# EAGLE design base-1 (EAGLE 9.6.2)
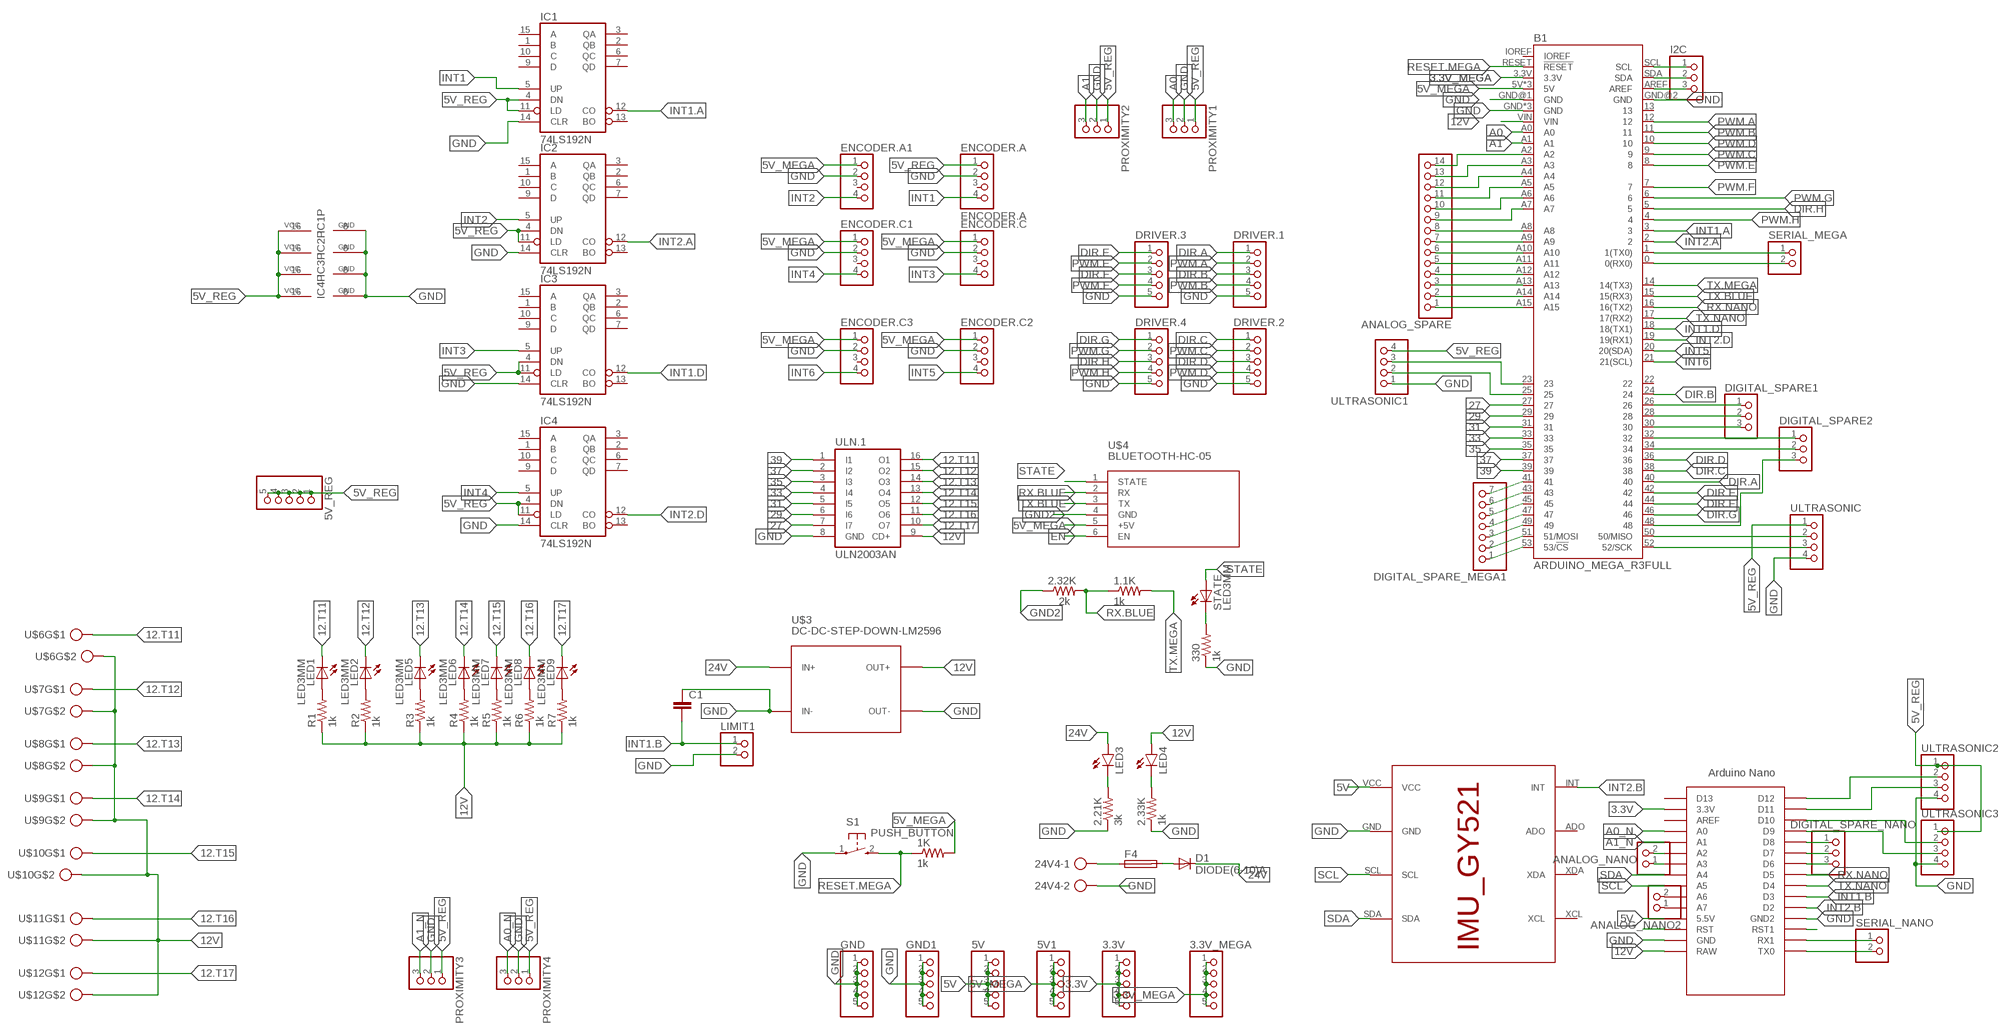
[diagram p0: schematic, sheet 1]

## Parts
1.1K  1k  RES-5  [0204/5]
1K  1k  RES-5  [0204/5]
2.21K  3k  RES-5  [0204/5]
2.32K  2k  RES-5  [0204/5]
2.33K  1k  RES-5  [0204/5]
3.3V  PINHD-1X5  [1X05]
3.3V_MEGA  PINHD-1X5  [1X05]
5V  PINHD-1X5  [1X05]
5V1  PINHD-1X5  [1X05]
5V_REG  PINHD-1X5  [1X05]
24V4  ROSTA.POWER  [W239-302]
330  1k  RES-5  [0204/5]
ANALOG_NANO  PINHD-1X2  [1X02]
ANALOG_NANO2  PINHD-1X2  [1X02]
ANALOG_SPARE  PINHD-1X14  [1X14]
B1  ARDUINO_MEGA_R3FULL  [ARDUINO_MEGA_NO_SILK]
C1  CAPACITOR  [C025-025X050]
D1  DIODE(6-10)A  [DO201-15]
DIGITAL_SPARE1  PINHD-1X3  [1X03]
DIGITAL_SPARE2  PINHD-1X3  [1X03]
DIGITAL_SPARE_MEGA1  PINHD-1X7  [1X07]
DIGITAL_SPARE_NANO  PINHD-1X3  [1X03]
DRIVER.1  PINHD-1X5  [1X05]
DRIVER.2  PINHD-1X5  [1X05]
DRIVER.3  PINHD-1X5  [1X05]
DRIVER.4  PINHD-1X5  [1X05]
ENCODER.A  ENCODER.A  PINHD-1X4  [1X04]
ENCODER.A1  PINHD-1X4  [1X04]
ENCODER.C  PINHD-1X4  [1X04]
ENCODER.C1  PINHD-1X4  [1X04]
ENCODER.C2  PINHD-1X4  [1X04]
ENCODER.C3  PINHD-1X4  [1X04]
F4  FUSE_HOLDER  [SH22,5A]
GND  PINHD-1X5  [1X05]
GND1  PINHD-1X5  [1X05]
I2C  PINHD-1X3  [1X03]
IC1  74LS192N  [DIL16]
IC2  74LS192N  [DIL16]
IC3  74LS192N  [DIL16]
IC4  74LS192N  [DIL16]
LED1  LED3MM  [LED3MM]
LED2  LED3MM  [LED3MM]
LED3  LED5MM  [LED5MM]
LED4  LED5MM  [LED5MM]
LED5  LED3MM  [LED3MM]
LED6  LED3MM  [LED3MM]
LED7  LED3MM  [LED3MM]
LED8  LED3MM  [LED3MM]
LED9  LED3MM  [LED3MM]
LIMIT1  PINHD-1X2  [1X02]
PROXIMITY1  PINHD-1X3  [1X03]
PROXIMITY2  PINHD-1X3  [1X03]
PROXIMITY3  PINHD-1X3  [1X03]
PROXIMITY4  PINHD-1X3  [1X03]
R1  1k  RES-5  [0204/5]
R2  1k  RES-5  [0204/5]
R3  1k  RES-5  [0204/5]
R4  1k  RES-5  [0204/5]
R5  1k  RES-5  [0204/5]
R6  1k  RES-5  [0204/5]
R7  1k  RES-5  [0204/5]
S1  PUSH_BUTTON  [B3F-10XX]
SERIAL_MEGA  PINHD-1X2  [1X02]
SERIAL_NANO  PINHD-1X2  [1X02]
STATE  LED3MM  [LED3MM]
U$1  ARDUINO_NANO  [NANO]
U$3  DC-DC-STEP-DOWN-LM2596  [DC-DC-STEP-DOWN-LM2596]
U$4  BLUETOOTH-HC-05  [WIRELESS-BLUETOOTH-HC-05]
U$5  IMU_ROBOCON_GY521  [IMU_GY521]
U$6  CON_PTR_2  [AK300/2]
U$7  CON_PTR_2  [AK300/2]
U$8  CON_PTR_2  [AK300/2]
U$9  CON_PTR_2  [AK300/2]
U$10  CON_PTR_2  [AK300/2]
U$11  CON_PTR_2  [AK300/2]
U$12  CON_PTR_2  [AK300/2]
ULN.1  ULN2003AN  [DIL16]
ULTRASONIC  PINHD-1X4  [1X04]
ULTRASONIC1  PINHD-1X4  [1X04]
ULTRASONIC2  PINHD-1X4  [1X04]
ULTRASONIC3  PINHD-1X4  [1X04]

## Nets
3.3V: 3.3V.1 3.3V.2 3.3V.3 3.3V.4 3.3V.5 U$1.3.3V
3.3V_MEGA: 3.3V_MEGA.1 3.3V_MEGA.2 3.3V_MEGA.3 3.3V_MEGA.4 3.3V_MEGA.5 B1.3.3V
5V: 5V.1 5V.2 5V.3 5V.4 5V.5 U$1.5V(5.5V) U$5.VCC
5V_MEGA: 1K.2 5V1.1 5V1.2 5V1.3 5V1.4 5V1.5 B1.5V B1.5V@1(5V) B1.5V@2(5V) ENCODER.A1.1 ENCODER.C1.1 ENCODER.C2.1 ENCODER.C3.1 ENCODER.C.1 U$4.5(+5V)
5V_REG: 5V_REG.1 5V_REG.2 5V_REG.3 5V_REG.4 5V_REG.5 ENCODER.A.1 IC1.4(DN) IC1.11(LD) IC1.16(VCC) IC2.4(DN) IC2.11(LD) IC2.16(VCC) IC3.4(DN) IC3.11(LD) IC3.16(VCC) IC4.4(DN) IC4.11(LD) IC4.16(VCC) PROXIMITY1.1 PROXIMITY2.1 PROXIMITY3.1 PROXIMITY4.1 ULTRASONIC1.4 ULTRASONIC2.1 ULTRASONIC3.1 ULTRASONIC.1
12.T11: LED1.K(C) U$6.1 ULN.1.16(O1)
12.T12: LED2.K(C) U$7.1 ULN.1.15(O2)
12.T13: LED5.K(C) U$8.1 ULN.1.14(O3)
12.T14: LED6.K(C) U$9.1 ULN.1.13(O4)
12.T15: LED7.K(C) U$10.1 ULN.1.12(O5)
12.T16: LED8.K(C) U$11.1 ULN.1.11(O6)
12.T17: LED9.K(C) U$12.1 ULN.1.10(O7)
12V: B1.VIN LED4.A R1.1 R2.1 R3.1 R4.1 R5.1 R6.1 R7.1 U$1.RAW U$3.OUT+ U$6.2 U$7.2 U$8.2 U$9.2 U$10.2 U$11.2 U$12.2 ULN.1.9(CD+)
24V: D1.C LED3.A U$3.IN+
27: B1.27 ULN.1.7(I7)
29: B1.29 ULN.1.6(I6)
31: B1.31 ULN.1.5(I5)
33: B1.33 ULN.1.4(I4)
35: B1.35 ULN.1.3(I3)
37: B1.37 ULN.1.2(I2)
39: B1.39 ULN.1.1(I1)
48: B1.48 DIGITAL_SPARE2.3
A0: B1.A0 PROXIMITY1.3
A0_N: PROXIMITY4.3 U$1.A0
A1: B1.A1 PROXIMITY2.3
A1_N: PROXIMITY3.3 U$1.A1
DIR.A: B1.40 DRIVER.1.1
DIR.B: B1.24 DRIVER.1.3
DIR.C: B1.38 DRIVER.2.1
DIR.D: B1.36 DRIVER.2.3
DIR.E: B1.42 DRIVER.3.1
DIR.F: B1.44 DRIVER.3.3
DIR.G: B1.46 DRIVER.4.1
DIR.H: B1.5 DRIVER.4.3
EN: U$4.6(EN)
GND: 2.21K.1 2.33K.1 24V4.2 330.1 B1.GND B1.GND@1(GND) B1.GND@2(GND) B1.GND@3(GND) B1.GND@4(GND) C1.1 DRIVER.1.5 DRIVER.2.5 DRIVER.3.5 DRIVER.4.5 ENCODER.A1.2 ENCODER.A.2 ENCODER.C1.2 ENCODER.C2.2 ENCODER.C3.2 ENCODER.C.2 GND1.1 GND1.2 GND1.3 GND1.4 GND1.5 GND.1 GND.2 GND.3 GND.4 GND.5 IC1.8(GND) IC1.14(CLR) IC2.8(GND) IC2.14(CLR) IC3.8(GND) IC3.14(CLR) IC4.8(GND) IC4.14(CLR) LIMIT1.2 PROXIMITY1.2 PROXIMITY2.2 PROXIMITY3.2 PROXIMITY4.2 S1.1(P) U$1.GND U$1.GND1(GND2) U$3.IN- U$3.OUT- U$5.GND ULN.1.8(GND) ULTRASONIC1.1 ULTRASONIC2.4 ULTRASONIC3.4 ULTRASONIC.4
GND2: 2.32K.1 U$4.4(GND)
INT1: ENCODER.A.4 IC1.5(UP)
INT1.A: B1.3 IC1.12(CO)
INT1.B: C1.2 LIMIT1.1 U$1.D3
INT1.D: B1.18(18(TX1)) IC3.12(CO)
INT2: ENCODER.A1.4 IC2.5(UP)
INT2.A: B1.2 IC2.12(CO)
INT2.B: U$1.D2 U$5.INT
INT2.D: B1.19(19(RX1)) IC4.12(CO)
INT3: ENCODER.C.4 IC3.5(UP)
INT4: ENCODER.C1.4 IC4.5(UP)
INT5: B1.20(20(SDA)) ENCODER.C2.4
INT6: B1.21(21(SCL)) ENCODER.C3.4
N$1: B1.SCL I2C.1
N$2: B1.SDA I2C.2
N$3: B1.AREF I2C.3
N$6: ANALOG_SPARE.1 B1.A15
N$7: 24V4.1 F4.1
N$8: ANALOG_SPARE.2 B1.A14
N$9: ANALOG_SPARE.3 B1.A13
N$10: ANALOG_SPARE.4 B1.A12
N$11: ANALOG_SPARE.5 B1.A11
N$12: ANALOG_SPARE.6 B1.A10
N$13: ANALOG_SPARE.7 B1.A9
N$14: ANALOG_SPARE.8 B1.A8
N$15: ANALOG_SPARE.9 B1.A7
N$17: B1.1(1(TX0)) SERIAL_MEGA.1
N$18: B1.0(0(RX0)) SERIAL_MEGA.2
N$21: 330.2 STATE.K(C)
N$23: 2.21K.2 LED3.K(C)
N$24: 2.33K.2 LED4.K(C)
N$25: D1.A F4.2
N$27: LED1.A R1.2
N$28: LED2.A R2.2
N$29: LED5.A R3.2
N$30: LED6.A R4.2
N$31: LED7.A R5.2
N$32: LED8.A R6.2
N$33: LED9.A R7.2
N$35: B1.23 ULTRASONIC1.3
N$36: B1.25 ULTRASONIC1.2
N$39: ANALOG_NANO.1 U$1.A3
N$40: ANALOG_NANO.2 U$1.A2
N$41: B1.50(50/MISO) ULTRASONIC.2
N$42: B1.52(52/SCK) ULTRASONIC.3
N$43: ANALOG_NANO2.1 U$1.A7
N$44: ANALOG_NANO2.2 U$1.A6
N$46: B1.26 DIGITAL_SPARE1.1
N$47: ANALOG_SPARE.10 B1.A6
N$48: ANALOG_SPARE.11 B1.A5
N$49: ANALOG_SPARE.12 B1.A4
N$50: B1.28 DIGITAL_SPARE1.2
N$51: B1.30 DIGITAL_SPARE1.3
N$52: ANALOG_SPARE.13 B1.A3
N$53: ANALOG_SPARE.14 B1.A2
N$54: B1.32 DIGITAL_SPARE2.1
N$55: B1.34 DIGITAL_SPARE2.2
N$75: B1.41 DIGITAL_SPARE_MEGA1.7
N$76: B1.45 DIGITAL_SPARE_MEGA1.5
N$77: B1.43 DIGITAL_SPARE_MEGA1.6
N$78: B1.47 DIGITAL_SPARE_MEGA1.4
N$79: B1.49 DIGITAL_SPARE_MEGA1.3
N$80: B1.51(51/MOSI) DIGITAL_SPARE_MEGA1.2
N$81: B1.53(53/!CS) DIGITAL_SPARE_MEGA1.1
N$119: U$1.RST
N$122: U$1.D12 ULTRASONIC2.2
N$123: U$1.D11 ULTRASONIC2.3
N$124: U$1.D10 ULTRASONIC3.2
N$125: U$1.D9 ULTRASONIC3.3
N$126: DIGITAL_SPARE_NANO.1 U$1.D8
N$127: DIGITAL_SPARE_NANO.2 U$1.D7
N$128: DIGITAL_SPARE_NANO.3 U$1.D6
N$134: U$1.RST1
N$135: SERIAL_NANO.1 U$1.RX1
N$136: SERIAL_NANO.2 U$1.TX0
PWM.A: B1.12 DRIVER.1.2
PWM.B: B1.11 DRIVER.1.4
PWM.C: B1.9 DRIVER.2.2
PWM.D: B1.10 DRIVER.2.4
PWM.E: B1.8 DRIVER.3.2
PWM.F: B1.7 DRIVER.3.4
PWM.G: B1.6 DRIVER.4.2
PWM.H: B1.4 DRIVER.4.4
RESET.MEGA: 1K.1 B1.RESET(!RESET) S1.2(S)
RX.BLUE: 1.1K.1 2.32K.2 U$4.2(RX)
RX.NANO: B1.16(16(TX2)) U$1.D5
SCL: U$1.A5 U$5.SCL
SDA: U$1.A4 U$5.SDA
STATE: STATE.A U$4.1(STATE)
TX.BLUE: B1.15(15(RX3)) U$4.3(TX)
TX.MEGA: 1.1K.2 B1.14(14(TX3))
TX.NANO: B1.17(17(RX2)) U$1.D4
Unconnected: B1.13 B1.22 B1.IOREF ENCODER.A1.3 ENCODER.A.3 ENCODER.C1.3 ENCODER.C2.3 ENCODER.C3.3 ENCODER.C.3 IC1.1(B) IC1.2(QB) IC1.3(QA) IC1.6(QC) IC1.7(QD) IC1.9(D) IC1.10(C) IC1.13(BO) IC1.15(A) IC2.1(B) IC2.2(QB) IC2.3(QA) IC2.6(QC) IC2.7(QD) IC2.9(D) IC2.10(C) IC2.13(BO) IC2.15(A) IC3.1(B) IC3.2(QB) IC3.3(QA) IC3.6(QC) IC3.7(QD) IC3.9(D) IC3.10(C) IC3.13(BO) IC3.15(A) IC4.1(B) IC4.2(QB) IC4.3(QA) IC4.6(QC) IC4.7(QD) IC4.9(D) IC4.10(C) IC4.13(BO) IC4.15(A) U$1.AREF U$1.D13 U$5.ADO U$5.XCL U$5.XDA

## Library data of the parts
1.1K 1K 2.21K 2.32K 2.33K 330 R1-R7 = MIA_LIBRARY-2-2-2:RES-5
3.3V 3.3V_MEGA 5V 5V1 5V_REG DRIVER.1-DRIVER.4 GND GND1 = pinhead:PINHD-1X5: PIN HEADER
24V4 = MIA_LIBRARY-2-2-2:ROSTA.POWER: WAGO SCREW CLAMP; OC_FARNELL: unknown; OC_NEWARK: unknown
ANALOG_NANO ANALOG_NANO2 LIMIT1 SERIAL_MEGA SERIAL_NANO = pinhead:PINHD-1X2: PIN HEADER
ANALOG_SPARE = pinhead:PINHD-1X14: PIN HEADER
B1 = MIA_LIBRARY-2-2-2:ARDUINO_MEGA_R3: Arduino Mega R3 ATmega2560 R3 compatible footprint. SparkFun Products: Arduino Mega 2560 R3 <https://www.sparkfun.com/products/11061>
C1 = MIA_LIBRARY-2-2-2:CAPACITOR
D1 = MIA_LIBRARY-2-2-2:DIODE(6-10)A: DIODE controlled avalanche rectifier
DIGITAL_SPARE1 DIGITAL_SPARE2 DIGITAL_SPARE_NANO I2C PROXIMITY1-PROXIMITY4 = pinhead:PINHD-1X3: PIN HEADER
DIGITAL_SPARE_MEGA1 = pinhead:PINHD-1X7: PIN HEADER
ENCODER.A ENCODER.A1 ENCODER.C ENCODER.C1-ENCODER.C3 ULTRASONIC ULTRASONIC1-ULTRASONIC3 = pinhead:PINHD-1X4: PIN HEADER
F4 = MIA_LIBRARY-2-2-2:FUSE_HOLDER
IC1-IC4 = 74xx-us:74*192: Synchronous 4-bit UP/DOWN COUNTER
LED1 LED2 LED5-LED9 STATE = MIA_LIBRARY-2-2-2:LED3MM
LED3 LED4 = led:LED: LED OSRAM: - CHIPLED LG R971, LG N971, LY N971, LG Q971, LY Q971, LO R971, LY R971 LH N974, LH R974 LS Q976, LO Q976, LY Q976 LO Q996 - Hyper CHIPLED LW Q18S LB Q993, LB Q99A, LB R99A - SideLED LS A670, LO A670, LY A670, LG A670, LP A670 LB A673, LV A673, LT A673, LW A673 LH A674 LY A675 LS A676, LA A676, LO A676, LY A676, LW A676 LS A679, LY A679, LG A679 - Hyper Micro SIDELED® LS Y876, LA Y876, LO Y876, LY Y876 LT Y87S - SmartLED LW L88C, LW L88S LB L89C, LB L89S, LG L890 LS L89K, LO L89K, LY L89K LS L896, LA L896, LO L896, LY L896 - TOPLED LS T670, LO T670, LY T670, LG T670, LP T670 LSG T670, LSP T670, LSY T670, LOP T670, LYG T670 LG T671, LOG T671, LSG T671 LB T673, LV T673, LT T673, LW T673 LH T674 LS T676, LA T676, LO T676, LY T676, LB T676, LH T676, LSB T676, LW T676 LB T67C, LV T67C, LT T67C, LS T67K, LO T67K, LY T67K, LW E67C LS E67B, LA E67B, LO E67B, LY E67B, LB E67C, LV E67C, LT E67C LW T67C LS T679, LY T679, LG T679 LS T770, LO T770, LY T770, LG T770, LP T770 LB T773, LV T773, LT T773, LW T773 LH T774 LS E675, LA E675, LY E675, LS T675 LS T776, LA T776, LO T776, LY T776, LB T776 LHGB T686 LT T68C, LB T68C - Hyper Mini TOPLED® LB M676 - Mini TOPLED Santana® LG M470 LS M47K, LO M47K, LY M47K Source: http://www.osram.convergy.de LUXEON: - LUMILED® LXK2-PW12-R00, LXK2-PW12-S00, LXK2-PW14-U00, LXK2-PW14-V00 LXK2-PM12-R00, LXK2-PM12-S00, LXK2-PM14-U00 LXK2-PE12-Q00, LXK2-PE12-R00, LXK2-PE12-S00, LXK2-PE14-T00, LXK2-PE14-U00 LXK2-PB12-K00, LXK2-PB12-L00, LXK2-PB12-M00, LXK2-PB14-N00, LXK2-PB14-P00, LXK2-PB14-Q00 LXK2-PR12-L00, LXK2-PR12-M00, LXK2-PR14-Q00, LXK2-PR14-R00 LXK2-PD12-Q00, LXK2-PD12-R00, LXK2-PD12-S00 LXK2-PH12-R00, LXK2-PH12-S00 LXK2-PL12-P00, LXK2-PL12-Q00, LXK2-PL12-R00 Source: www.luxeon.com KINGBRIGHT: KA-3528ASYC Source: www.kingbright.com
S1 = MIA_LIBRARY-2-2-2:PUSH_BUTTON: OMRON SWITCH
U$1 = MIA_LIBRARY-2-2-2:ARDUINO_NANO: Arduino Nano
U$3 = MIA_LIBRARY-2-2-2:DC-DC-STEP-DOWN-LM2596: DC/DC Step-Down Regulator based on LM2596-ADJ chip LM2596 datasheet available here: http://www.ti.com/lit/ds/symlink/lm2596.pdf Click here to find device on ebay.com <http://www.ebay.com/sch/lm2596+power+regulator>
U$4 = MIA_LIBRARY-2-2-2:BLUETOOTH-HC-05: Bluetooth Transceiver Module based on HC-05 board Tutorial is available here: https://arduino-info.wikispaces.com/BlueTooth-HC05-HC06-Modules-How-To Click here to find device on ebay.com <http://www.ebay.com/sch/hc-05+module+rs232>
U$5 = MIA_LIBRARY-2-2-2:IMU_ROBOCON_GY521
U$6-U$12 = MIA_LIBRARY-2-2-2:CON_PTR_2
ULN.1 = MIA_LIBRARY-2-2-2:ULN2003A: DRIVER ARRAY

## Board
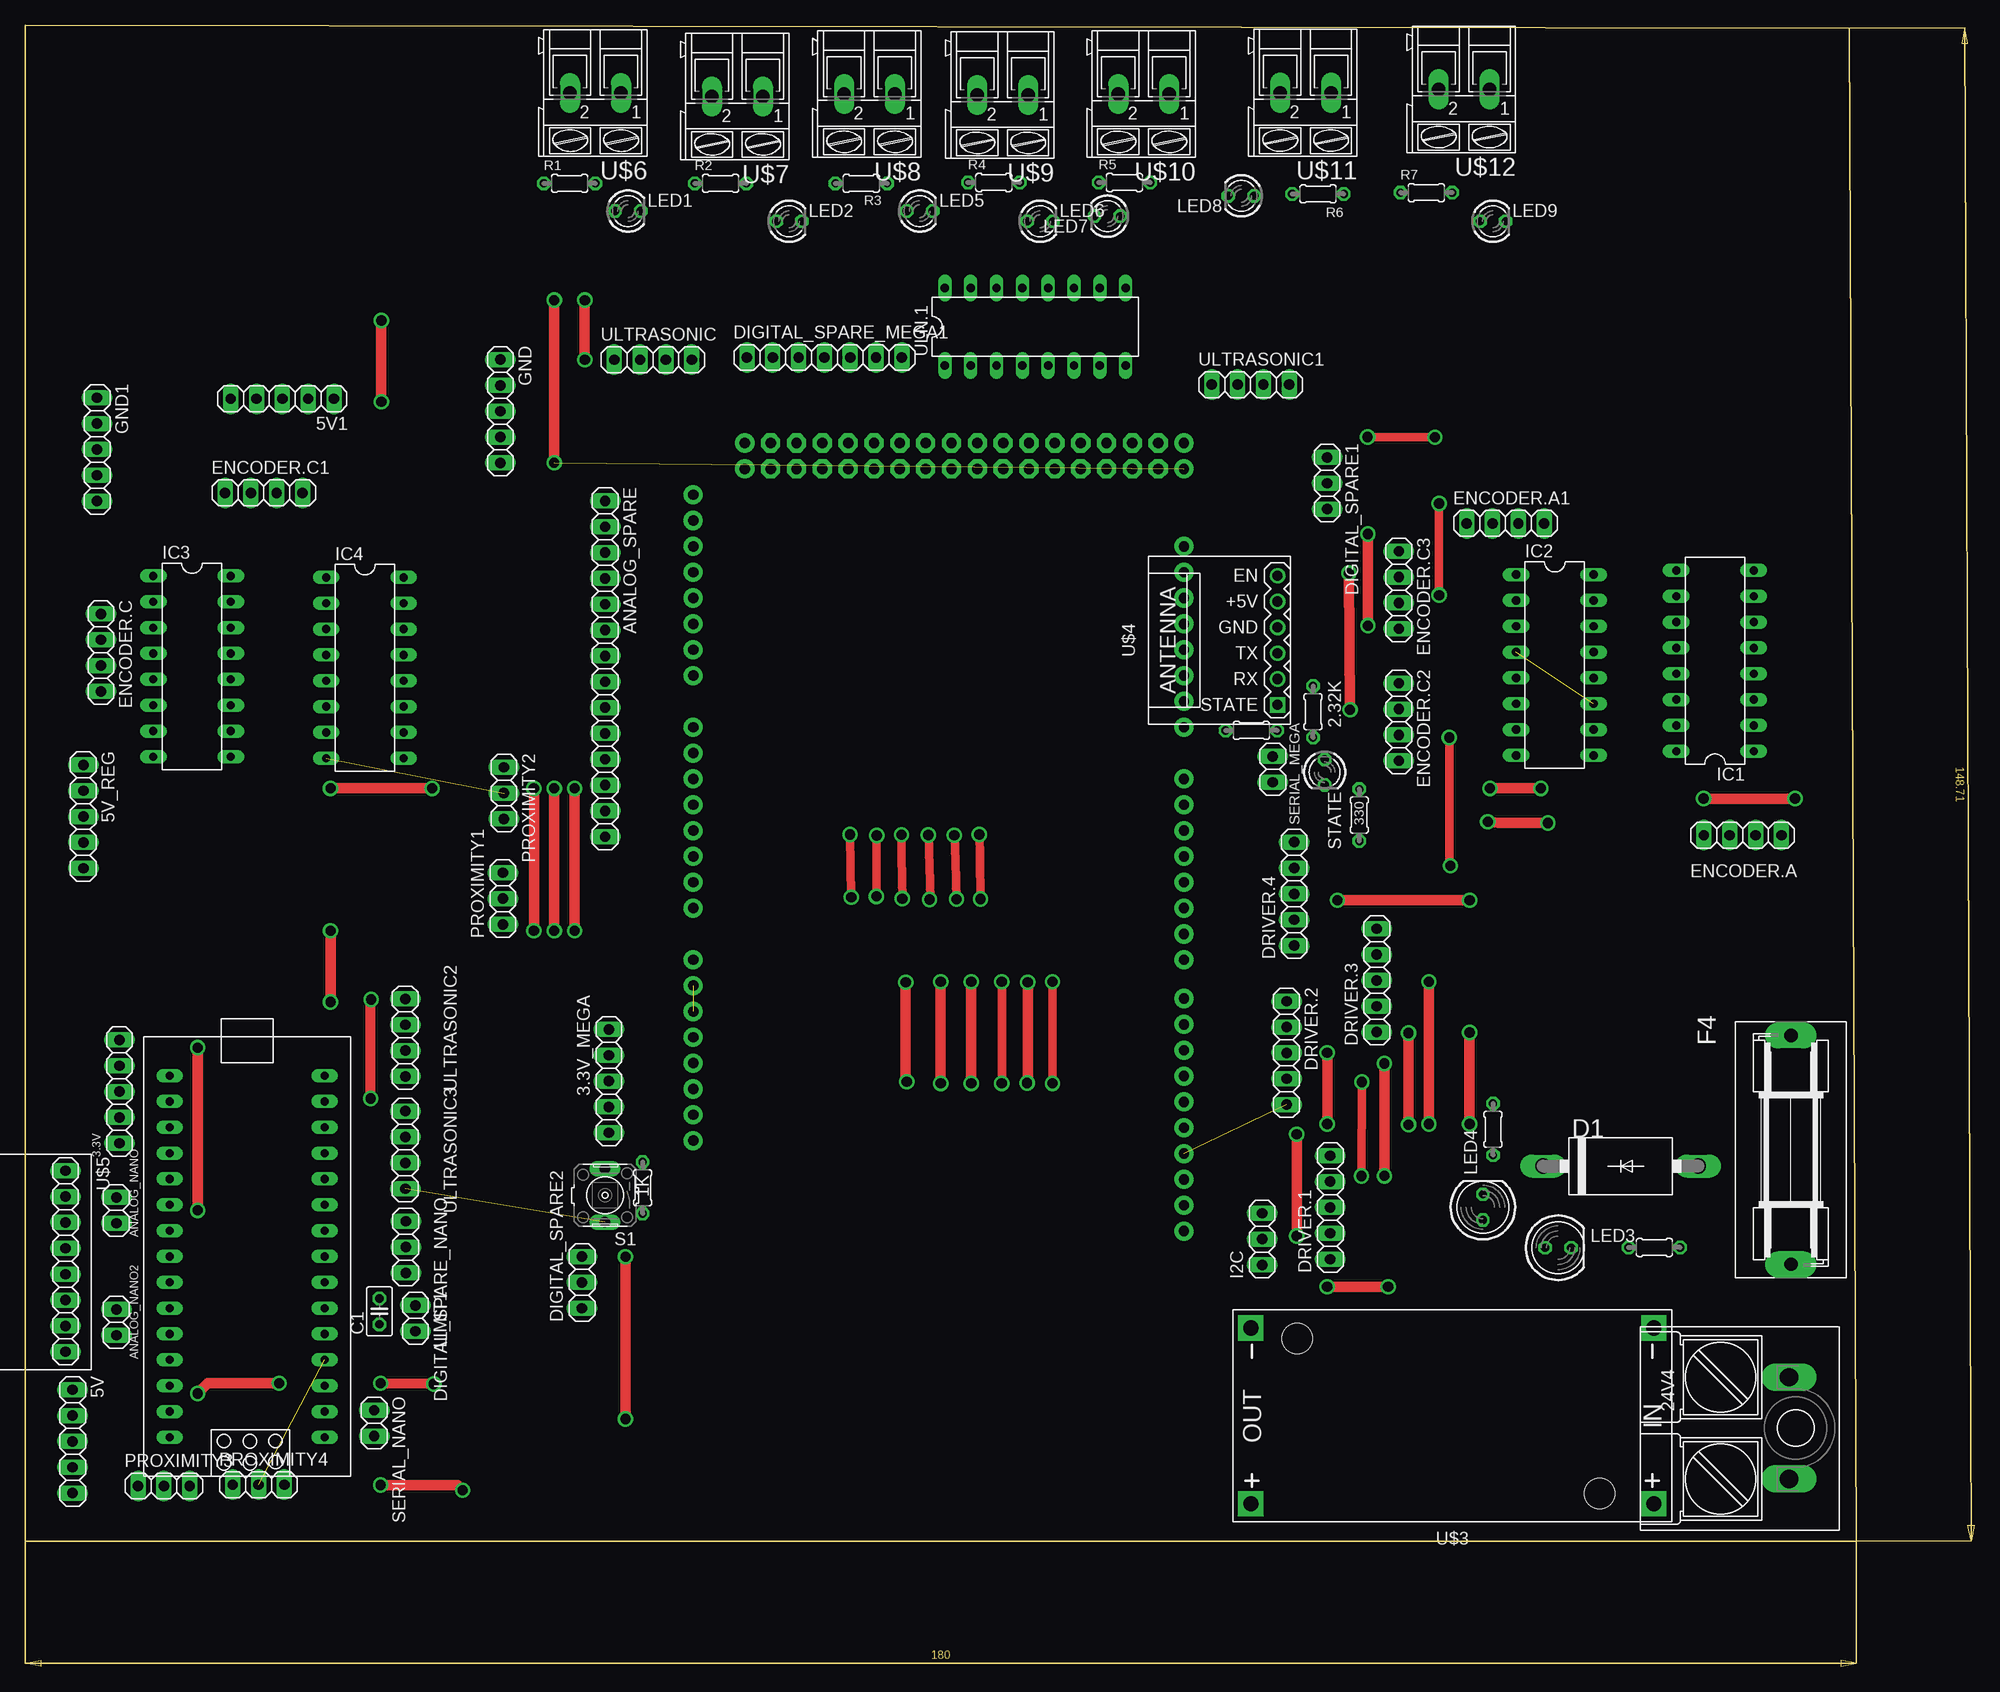
[diagram p1: board, top side]
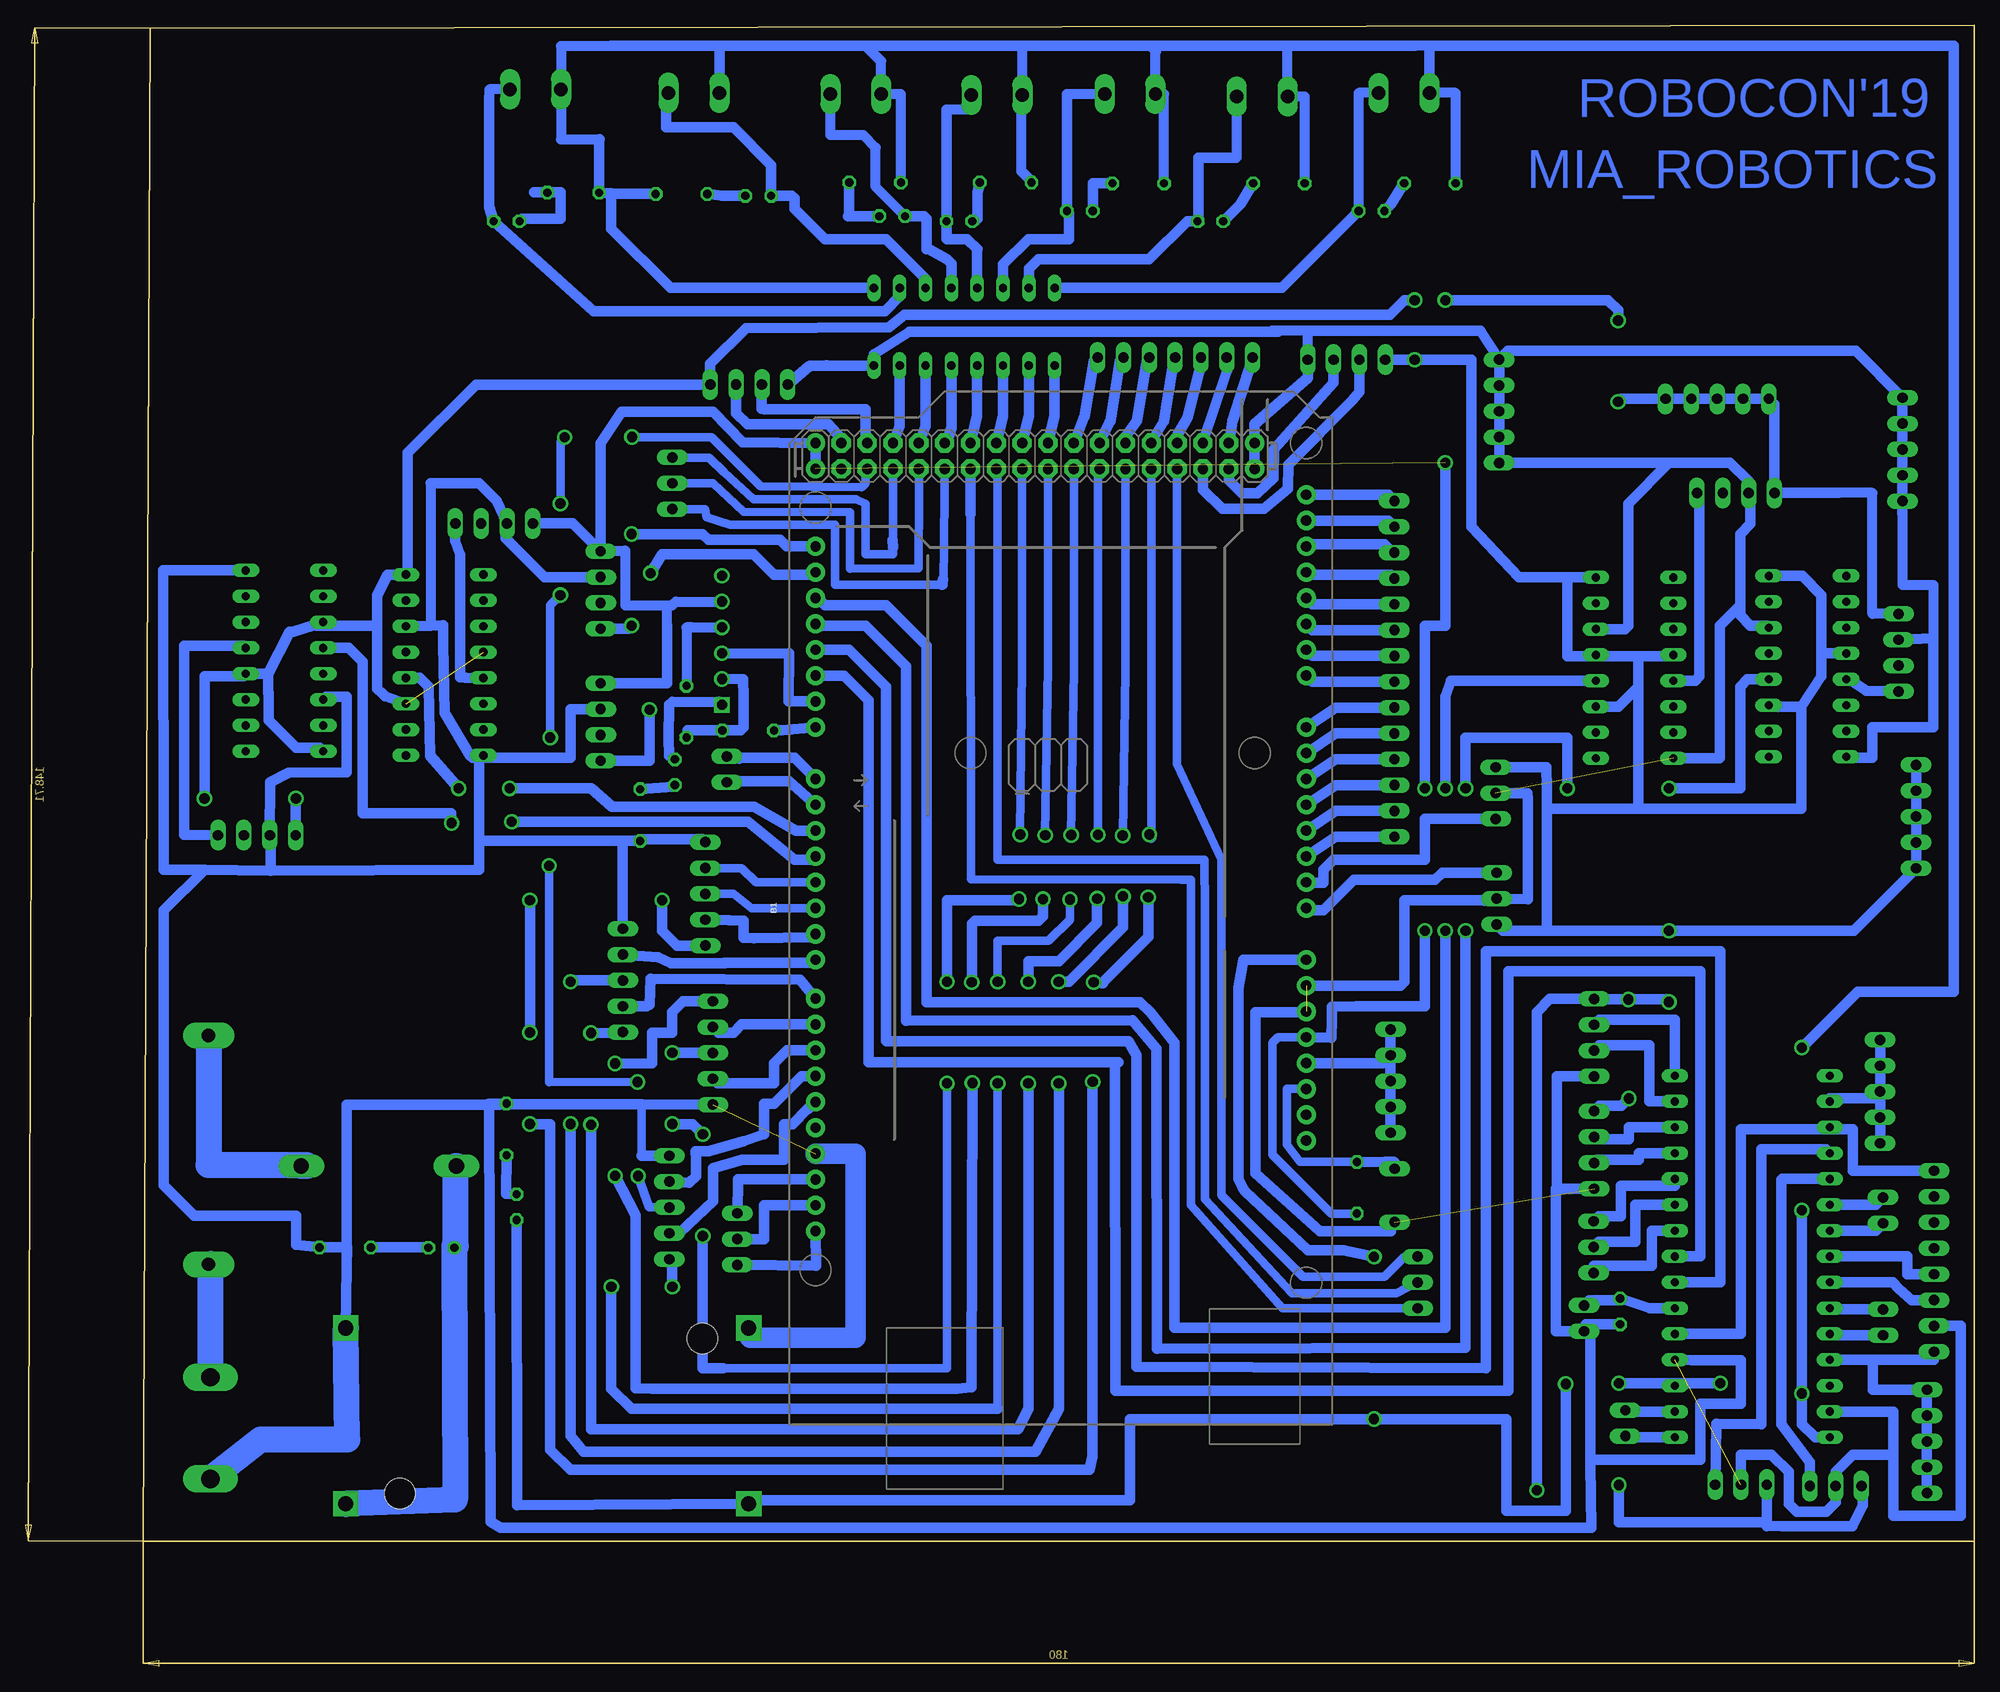
[diagram p2: board, bottom side, seen from below]

Size 180 x 149 mm. Coordinates in mm from the lower left corner, seen from the top.
Outline: 0,0 180,0 179.35,148.71 0,149 0,0
Copper layers (1*16): Top 0.035mm / dielectric 1.5mm / Bottom 0.035mm
Design rules "default *": minimum track width 0.8mm, minimum drill 0.8mm, track to track 0.4mm, track to pad 0.4mm, pad to pad 6mil, via to via 6mil, smd to smd 6mil, copper to edge 0.6mm, drill to drill 6mil, minimum pad ring 10mil, minimum via ring 8mil, stop-mask expansion 4mil, vias tented up to drill 0mil, thermal gap 10mil

### Footprints (pad centres in the part's own frame; a part is rotated, then mirrored left to right if it is on the bottom)
0204/5 = drill 0.813 octagon: 1 -2.54,0; 2 2.54,0
1X05 = drill 1.016 long: 1 -5.08,0; 2 -2.54,0; 3 0,0; 4 2.54,0; 5 5.08,0
W239-302 = drill 1.8 long: 1 -5,5; 2 5,5
1X02 = drill 1.016 long: 1 -1.27,0; 2 1.27,0
1X14 = drill 1.016 long: 1 -16.51,0; 2 -13.97,0; 3 -11.43,0; 4 -8.89,0; 5 -6.35,0; 6 -3.81,0; 7 -1.27,0; 8 1.27,0; 9 3.81,0; 10 6.35,0; 11 8.89,0; 12 11.43,0; 13 13.97,0; 14 16.51,0
ARDUINO_MEGA_NO_SILK = drill 1.016 pad 1.88: 0 13.97,24.13; 1 11.43,24.13; 2 8.89,24.13; 3 6.35,24.13; 3.3V -13.97,-24.13; 4 3.81,24.13; 5 1.27,24.13; 5V -11.43,-24.13; 5V@1 44.45,24.13; 5V@2 46.99,24.13; 6 -1.27,24.13; 7 -3.81,24.13; 8 -7.62,24.13; 9 -10.16,24.13; 10 -12.7,24.13; 11 -15.24,24.13; 12 -17.78,24.13; 13 -20.32,24.13; 14 19.05,24.13; 15 21.59,24.13; 16 24.13,24.13; 17 26.67,24.13; 18 29.21,24.13; 19 31.75,24.13; 20 34.29,24.13; 21 36.83,24.13; A0 1.27,-24.13; A1 3.81,-24.13; A2 6.35,-24.13; A3 8.89,-24.13; A4 11.43,-24.13; A5 13.97,-24.13; A6 16.51,-24.13; A7 19.05,-24.13; A8 24.13,-24.13; A9 26.67,-24.13; A10 29.21,-24.13; A11 31.75,-24.13; A12 34.29,-24.13; A13 36.83,-24.13; A14 39.37,-24.13; A15 41.91,-24.13; AREF -25.4,24.13; GND -8.89,-24.13; GND@1 -6.35,-24.13; GND@2 44.45,-19.05; GND@3 46.99,-19.05; GND@4 -22.86,24.13; IOREF -19.05,-24.13; NC -21.59,-24.13; RESET -16.51,-24.13; SCL -30.48,24.13; SDA -27.94,24.13; VIN -3.81,-24.13 | drill 1.016 pad 1.88 octagon: 22 44.45,21.59; 23 46.99,21.59; 24 44.45,19.05; 25 46.99,19.05; 26 44.45,16.51; 27 46.99,16.51; 28 44.45,13.97; 29 46.99,13.97; 30 44.45,11.43; 31 46.99,11.43; 32 44.45,8.89; 33 46.99,8.89; 34 44.45,6.35; 35 46.99,6.35; 36 44.45,3.81; 37 46.99,3.81; 38 44.45,1.27; 39 46.99,1.27; 40 44.45,-1.27; 41 46.99,-1.27; 42 44.45,-3.81; 43 46.99,-3.81; 44 44.45,-6.35; 45 46.99,-6.35; 46 44.45,-8.89; 47 46.99,-8.89; 48 44.45,-11.43; 49 46.99,-11.43; 50 44.45,-13.97; 51 46.99,-13.97; 52 44.45,-16.51; 53 46.99,-16.51
C025-025X050 = drill 0.813 octagon: 1 -1.27,0; 2 1.27,0
DO201-15 = drill 1.499 long: A 7.62,0; C -7.62,0
1X03 = drill 1.016 long: 1 -2.54,0; 2 0,0; 3 2.54,0
1X07 = drill 1.016 long: 1 -7.62,0; 2 -5.08,0; 3 -2.54,0; 4 0,0; 5 2.54,0; 6 5.08,0; 7 7.62,0
1X04 = drill 1.016 long: 1 -3.81,0; 2 -1.27,0; 3 1.27,0; 4 3.81,0
SH22,5A = drill 1.321 pad 2.54 long: 1 -11.252,0; 2 11.252,0
DIL16 = drill 0.813 long: 1 -8.89,-3.81; 2 -6.35,-3.81; 3 -3.81,-3.81; 4 -1.27,-3.81; 5 1.27,-3.81; 6 3.81,-3.81; 7 6.35,-3.81; 8 8.89,-3.81; 9 8.89,3.81; 10 6.35,3.81; 11 3.81,3.81; 12 1.27,3.81; 13 -1.27,3.81; 14 -3.81,3.81; 15 -6.35,3.81; 16 -8.89,3.81
LED3MM = drill 0.813 octagon: A -1.27,0; K 1.27,0
LED5MM = drill 0.813 octagon: A -1.27,0; K 1.27,0
B3F-10XX = drill 1.016 long: 1 0.013,2.636; 2 0.029,-2.605
NANO = drill 0.8 long: 3.3V -10.16,24.13; 5V -10.16,-1.27; A0 -10.16,19.05; A1 -10.16,16.51; A2 -10.16,13.97; A3 -10.16,11.43; A4 -10.16,8.89; A5 -10.16,6.35; A6 -10.16,3.81; A7 -10.16,1.27; AREF -10.16,21.59; D2 5.08,1.27; D3 5.08,3.81; D4 5.08,6.35; D5 5.08,8.89; D6 5.08,11.43; D7 5.08,13.97; D8 5.08,16.51; D9 5.08,19.05; D10 5.08,21.59; D11 5.08,24.13; D12 5.08,26.67; D13 -10.16,26.67; GND -10.16,-6.35; GND1 5.08,-1.27; RAW -10.16,-8.89; RST -10.16,-3.81; RST1 5.08,-3.81; RX1 5.08,-6.35; TX0 5.08,-8.89
DC-DC-STEP-DOWN-LM2596 = drill 1.5 pad 2.5 square: IN+ -19.812,8.636; IN- -19.812,-8.636; OUT+ 19.812,8.636; OUT- 19.812,-8.636 | hole 3: -14.478,7.62; 15.24,-7.62
WIRELESS-BLUETOOTH-HC-05 = drill 1 square: 1 -6.35,-17.145 | drill 1: 2 -3.81,-17.145; 3 -1.27,-17.145; 4 1.27,-17.145; 5 3.81,-17.145; 6 6.35,-17.145
IMU_GY521 = drill 1.016 long: ADO -6.35,0; GND 6.35,0; INT -8.89,0; SCL 3.81,0; SDA 1.27,0; VCC 8.89,0; XCL -3.81,0; XDA -1.27,0
AK300/2 = drill 1.321 long: 1 -2.515,0; 2 2.489,0

### Placement (x,y rotation side)
1.1K  120.54,79.7 180 top
1K  60.69,34.74 270 top
2.21K  160.17,28.87 180 top
2.32K  126.6,81.54 270 top
2.33K  144.3,40.48 270 top
3.3V  9.24,44.2 90 top
3.3V_MEGA  57.37,45.22 90 top
5V  4.64,9.81 270 top
5V1  25.26,112.3 180 top
5V_REG  5.7,71.23 270 top
24V4  168.41,11.12 270 top
330  131.16,71.38 90 top
ANALOG_NANO  8.94,32.52 90 top
ANALOG_NANO2  8.94,21.52 90 top
ANALOG_SPARE  57,85.75 270 top
B1  89.79,60.96 90 bottom
C1  34.81,22.59 90 top
D1  156.86,36.87 0 top
DIGITAL_SPARE1  128,104 270 top
DIGITAL_SPARE2  54.72,25.44 90 top
DIGITAL_SPARE_MEGA1  78.56,116.36 0 top
DIGITAL_SPARE_NANO  37.4,28.9 270 top
DRIVER.1  128.3,32.8 90 top
DRIVER.2  124,48 270 top
DRIVER.3  132.87,55.13 90 top
DRIVER.4  124.75,63.63 90 top
ENCODER.A  168.85,69.4 0 top
ENCODER.A1  145.53,100.05 0 top
ENCODER.C  7.42,87.35 270 top
ENCODER.C1  23.44,103.05 0 top
ENCODER.C2  135.05,80.53 270 top
ENCODER.C3  135.05,93.5 270 top
F4  173.59,38.47 90 top
GND  46.7,111.08 270 top
GND1  7.05,107.32 270 top
I2C  121.6,29.69 90 top
IC1  166.13,86.54 90 top
IC2  150.38,86.13 270 top
IC3  16.38,85.99 270 top
IC4  33.38,85.85 270 top
LED1  59.25,130.75 0 top
LED2  75.09,129.75 0 top
LED3  150.7,28.84 0 top
LED4  143.31,32.83 90 top
LED5  87.93,130.75 0 top
LED6  99.77,129.75 0 top
LED7  106.39,130.25 180 top
LED8  119.55,132.25 180 top
LED9  144.29,129.75 0 top
LIMIT1  38.35,21.91 270 top
PROXIMITY1  46.95,63.16 90 top
PROXIMITY2  47.05,73.54 270 top
PROXIMITY3  13.62,5.42 0 top
PROXIMITY4  22.92,5.55 0 top
R1  53.51,133.48 0 top
R2  68.35,133.48 0 top
R3  82.19,133.48 0 top
R4  95.22,133.56 0 top
R5  108.06,133.56 0 top
R6  127.1,132.44 180 top
R7  137.74,132.56 0 top
S1  57,34 180 top
SERIAL_MEGA  122.65,75.88 90 top
SERIAL_NANO  34.29,11.61 270 top
STATE  127.75,75.59 270 top
U$1  24.35,19.1 0 top
U$3  140.3,12.31 180 top
U$4  105.97,88.56 90 top
U$5  3.94,27.52 270 top
U$6  56.04,142.37 180 top
U$7  70,142 180 top
U$8  82.98,142.26 180 top
U$9  96.07,142.15 180 top
U$10  109.95,142.25 180 top
U$11  125.86,142.38 180 top
U$12  141.44,142.72 180 top
ULN.1  99.29,119.38 0 top
ULTRASONIC  61.71,116.14 0 top
ULTRASONIC1  120.46,113.69 0 top
ULTRASONIC2  37.35,49.49 270 top
ULTRASONIC3  37.35,38.46 270 top

### Tracks (layer width: path | path; a pad name or v marks a point on that pad's centre or on a via)
3.3V
  Bottom 1: 9.24,46.52 3.3V.5 3.3V.4
  Bottom 1.016: 3.3V.1 3.3V.2 9.24,43.52 | 9.24,46.52 3.3V.3 9.24,43.52 | U$1.3.3V 14.19,43.52 9.24,43.52
3.3V_MEGA
  Bottom 1.016: 3.3V_MEGA.5 3.3V_MEGA.4 | 3.3V_MEGA.4 3.3V_MEGA.3 3.3V_MEGA.2 3.3V_MEGA.1 | 3.3V_MEGA.4 58.14,46.99 B1.3.3V
5V
  Bottom 1.016: 5V.5 5V.4 5V.3 5V.2 5V.1 9.94,14.88 9.94,17.82 | U$5.VCC 3.94,17.82 9.94,17.82 | 9.94,17.82 U$1.5V
5V_MEGA  (via drill 1)  (1 unrouted)
  Top 1.016: v54,60 v54,74 | v52,106 v52,122 | v35,120 v35,112
  Bottom 0.813: 1K.2 63.2,32.2 69,38 69,49 68.47,49.53 B1.5V
  Bottom 1: U$4.5 127.63,92.37 128,92 128.52,92 | 132.62,92 128.52,92 | 128.52,90 128.52,92 | 132.62,97.36 132.62,92 | 132.62,92 132.63,92 | B1.5V@1 113.92,105.08 | ENCODER.C.1 10,91.16 10,103.05 13.29,103.05
  Bottom 1.016: 13.29,103.05 ENCODER.C1.1 19.63,111.75 5V1.5 5V1.4 5V1.3 5V1.2 5V1.1 34.7,112.3 v35,112 | 114,105 113.92,105.08 B1.5V@2 121.09,108 124,111 133,111 135.05,107.95 ENCODER.C3.1 | ENCODER.C2.1 128.52,84.32 128.52,90 128.52,90.02 | ENCODER.C3.1 132.62,97.36 | ENCODER.C3.1 137.79,100.05 ENCODER.A1.1 | B1.5V 63.18,49.49 63.12,51.29 63.12,52.54 60.73,52.61 54,52.57 v54,60 | v54,74 54,90 52,90 v52,106 | v52,122 36,122 35,121 v35,120
5V_REG  (via drill 1)  (1 unrouted)
  Top 1: v33.94,43.52 33.94,53.19
  Top 1.016: v43,5 42.48,5.51 v34.94,5.51 | 33.94,53.19 v34,53.25 | v30,60 v30,53 | v165,73 v174,73 | v55,116.14 | v55,116.14 v55,122
  Bottom 1: 18.91,1.46 20.38,1.46 20.38,2.52
  Bottom 1.016: PROXIMITY3.1 10.94,5.28 10.94,3.52 11.97,1.46 18.91,1.46 | PROXIMITY4.1 20.38,2.52 20.38,1.84 34.94,1.84 v34.94,5.51 | v43,5 43,52 41.7,53.3 38,53.3 | 38,53.3 ULTRASONIC2.1 | ULTRASONIC3.1 36.84,42.78 34.67,42.78 v33.94,43.52 | 38,53.3 37.57,53.25 v34,53.25 30.25,53.25 v30,53 | 5V_REG.1 5V_REG.2 | 5V_REG.4 5V_REG.5 | 5V_REG.2 5V_REG.5 | 5V_REG.3 5V_REG.2 | 42,60 v30,60 11.85,60 5V_REG.5 | 42,60 46.33,60 PROXIMITY1.1 | 42,60 42,72 | 42,72 42,74 42.08,76.08 PROXIMITY2.1 | IC4.4 29.69,87 33,87 | IC4.11 34.96,82.04 33,84 | 33,84 33,87 | 33,84 33,72 | 33,72 42,72 | 33,72 17,72 17,82 | 17,82 20,82 IC3.11 | 17,82 15,85 15,87 | 15,87 14.74,87.26 IC3.4 | IC3.16 16.88,94.88 15,93 15,87 | ULTRASONIC.1 v55,116.14 49.44,116.13 49.44,99.72 44.74,94.74 40,94.74 | 40,94.74 IC4.16 | 157,90 157,93 155.98,95.02 IC2.16 154,95.21 154,107 147.31,113.69 ULTRASONIC1.4 124.27,115.73 120.75,119.25 106.71,119.32 105.14,120.57 57.43,120.57 56,122 v55,122 | 157,90 162.97,90 IC1.11 165.29,89.38 165.63,89.38 167.74,85.27 | 167.74,85.27 IC1.4 170.21,85 174,85 v174,73 | IC2.11 156.22,83.04 156.5,83.29 157,83.79 157,90 | IC1.16 162.67,78 165,78 167.71,80.71 167.71,83.38 167.74,83.41 167.74,85.27 | ENCODER.A.1 165.04,72.96 v165,73 | 33,87 40,87 40,94.74
12.T11
  Bottom 1: U$6.1 60.52,142.37 LED1.K
  Bottom 1.016: ULN.1.16 68.08,123.19 LED1.K
12.T12
  Bottom 0.813: LED2.K 76.25,129.75
  Bottom 1: U$7.1 72.52,136 72.58,136
  Bottom 1.016: LED2.K 77.36,129.75 81.11,126 92,126 92.94,125.06 ULN.1.15 | 76.25,129.75 76.25,136 72.58,136
12.T13
  Bottom 1: U$8.1 89.2,142.26 89.2,142
  Bottom 1.016: 89.2,142 LED5.K 89,130.55 89,128 93,128 95.48,125.52 ULN.1.14
12.T14
  Bottom 1: U$9.1 98.59,140.69 101.04,140.69
  Bottom 1.016: 101.04,140.69 LED6.K 101.04,128.04 101,128 99,128 98,127 98.02,126.98 ULN.1.13
12.T15
  Bottom 1: U$10.1 112.46,138.22 109.22,138.22 108,137 108,133.13 LED7.K
  Bottom 1.016: ULN.1.12 100.56,125.56 101,126 102.75,127 103,127 103,130 103.25,130.25 LED7.K
12.T16
  Bottom 1: U$11.1 128.62,142.38 128.62,142.43
  Bottom 1.016: ULN.1.11 103.1,124.1 107,128 113,128 116,131 116,132 116.25,132.25 LED8.K 118.28,135.28 122,139 128.62,139 128.62,142.43
12.T17
  Bottom 1: U$12.1 146,142.72 146,142
  Bottom 1.016: ULN.1.10 105.64,122.36 107.08,120.92 135.72,120.92 LED9.K 146,131.19 146,142
12V  (via drill 1)
  Top 1: v34.94,15.52 40.09,15.52
  Top 1.016: v59,27.96 v59,12 | v16.94,14.52 17.94,15.52 v24.94,15.52 | 40.09,15.52 v40.15,15.46 | v16.94,32.52 v16.94,48.52
  Bottom 1: 134,147 138.95,147 U$12.2 138.95,137.8 135.17,137.8 | R1.1 50.97,142.37 U$6.2 | R2.1 65.81,142 U$7.2 67.51,147 | 80.46,146.46 80.49,146.46 U$8.2 79.65,142.26 R3.1 | 93.66,134.66 93.66,142.15 U$9.2 93.58,147 93,147 | R5.1 105.52,142.25 U$10.2 107.46,145.51 107.51,145.51 | 123.37,147 124,147 | 53.55,147 55,147
  Bottom 1.016: ULN.1.9 128.19,123.19 134,129 134,132.49 R7.1 | 135.17,137.8 135.2,137.69 R7.1 | 124,147 134,147 | U$11.2 123.37,147 109,147 | 107.51,145.51 109,147 | 109,147 93,147 81,147 | 80.46,146.46 81,147 | 81,147 67.51,147 55,147 | U$6.2 53.55,147 2,147 2,54 11.46,54 v16.94,48.52 | R4.1 92.56,133.56 93.66,134.66 | R6.1 133.81,132.44 R7.1 | B1.VIN 71.85,57.15 72.32,54.41 72.32,36.77 72.31,35.6 71.89,34.7 71.7,34.38 65.51,28.62 62,28.59 v59,27.96 | LED4.A 143.27,3.52 U$3.OUT+ 120.36,4 83,4 83,12 v59,12 46,12 46,3 40.15,3 v40.15,15.46 | U$1.RAW 15.63,10.21 16.94,11.52 v16.94,14.52 v16.94,32.52 | v24.94,15.52 v34.94,15.52
24V
  Bottom 1: LED3.A 149.3,28.84 149.3,29
  Bottom 2.54: D1.C 149.3,36.87 149.3,29 | 149.43,29 LED3.A 149.37,4.07 U$3.IN+
27
  Bottom 1.016: ULN.1.7 105.64,109.61 B1.27
29
  Bottom 1.016: ULN.1.6 103.1,109.61 B1.29
31
  Bottom 1.016: ULN.1.5 100.56,109.44 101.05,107.95 B1.31
33
  Bottom 1.016: ULN.1.4 98.02,110.61 B1.33
35
  Bottom 1.016: ULN.1.3 95.48,110.61 B1.35
37
  Bottom 1.016: ULN.1.2 92.94,110.61 B1.37
39
  Bottom 1.016: B1.39 90.4,110.61 ULN.1.1
48
  Bottom 0.813: B1.48 78.36,76.36 74,67 74,34 66,26 58,26 56.02,27.98 DIGITAL_SPARE2.3
A0
  Bottom 1.016: PROXIMITY1.3 52.3,65.7 53,65 61,65 64,62 65.43,62 B1.A0
A0_N
  Bottom 1.016: PROXIMITY4.3 25.33,11.52 20.94,11.52 20.94,38.52 14.56,38.52 U$1.A0
A1
  Bottom 1.016: PROXIMITY2.3 54,71 54,67 63,67 64,66 64,64.75 64.89,64.75 B1.A1
A1_N
  Bottom 1.016: PROXIMITY3.3 16.16,7.74 18.94,11.52 18.94,35.52 18.85,35.6 U$1.A1
DIR.A  (via drill 1)
  Top 0.813: v88.78,69.42 89,63.19 v88.91,63.08 | v96,55 v96,45
  Top 1.016: v134,25 v128,25
  Bottom 0.813: B1.40 88.52,85.67 v88.78,69.42 | v88.91,63.08 88.91,61.09 91,59 96,59 v96,55 | v96,45 96,13
  Bottom 1.016: 96,13 132,13 134,15 v134,25 | v128,25 128,27.42 DRIVER.1.1
DIR.B  (via drill 1)
  Top 0.813: v131.97,108.54 138.55,108.54 v138.58,108.52 | v139,102 v139,93 | v140,79 140,66.51 v140.11,66.4 | v131.38,35.89 v131.41,45.14
  Bottom 0.813: B1.24 109,105.25 109,104 109.38,103.62 119.35,103.68 121.59,105.97 124.16,108.54 v131.97,108.54 | v138.58,108.52 139,108.09 v139,102 | v139,93 140,92 v140,79 | DRIVER.1.3 130.29,32.84 v131.38,35.89 | v131.41,45.14 140.11,45.11 v140.11,66.4
DIR.C  (via drill 1)
  Top 0.813: v91.33,69.38 91.46,66.81 v91.56,63.12
  Top 1.016: v98.56,54.94 98.56,45.1 v98.5,45.03 | v133.62,35.91 v133.62,46.95
  Bottom 0.813: B1.38 91.06,85.98 v91.33,69.38
  Bottom 1.016: v98.5,45.03 98.59,15.13 100,15 130,15 131.61,15.02 131.61,32.02 v133.62,35.91 | DRIVER.2.1 126.92,53.08 128,52 128,50 130,50 130,47 v133.62,46.95 | v91.56,63.12 91.56,61.44 92,61 98.22,61 98.51,60.71 98.51,54.99 v98.56,54.94
DIR.D  (via drill 1)
  Top 0.813: v93.79,69.47 93.85,67.23 v93.92,63.12 | v101,55 v101,45
  Top 1.016: v125,30 v125,40 | v128,41 v128,48
  Bottom 0.813: B1.36 93.6,85.98 v93.79,69.47 | v101,45 101,17 123,17
  Bottom 1.016: 123,17 125,17 v125,30 | v125,40 126,41 v128,41 | v128,48 DRIVER.2.3 | v93.92,63.12 94.04,63 101,63 v101,55
DIR.E  (via drill 1)
  Top 0.813: v86.16,69.44 86.16,67.23 v86.22,63.17
  Top 1.016: v93,55 v93,45 | v136,40.95 v136,49.95
  Bottom 0.813: B1.42 86.16,105.23 v86.16,69.44
  Bottom 1.016: v86.22,63.17 86.22,60.78 90,57 93,57 v93,55 | v93,45 93,13 94,11 136,11 v136,40.95 | DRIVER.3.1 133.52,50 v136,49.95
DIR.F  (via drill 1)
  Top 0.813: v83.71,69.37 83.71,68.27 v83.67,63.38
  Top 1.016: v90,55 v90,45 | v138,41 v138,55
  Bottom 0.813: B1.44 83.44,85.64 v83.71,69.37
  Bottom 1.016: v83.67,63.38 83.67,60.33 89,55 v90,55 | v90,45 90,13 92.3,8.78 136.73,8.78 138,10.36 v138,41 | v138,55 137.87,55.13 DRIVER.3.3
DIR.G  (via drill 1)
  Top 0.813: v81.08,69.46 81.08,69.42 v81.2,63.3
  Top 1.016: v86.56,54.95 86.56,45.26 v86.66,45.16 | v142,41 v142,50 | v142,63 v129,63
  Bottom 0.813: 80.9,69.1 B1.46
  Bottom 1: v81.08,69.46 80.9,69.46 80.9,69.1
  Bottom 1.016: v81.2,63.3 81.2,59.4 85.74,54.86 85.65,54.86 v86.56,54.95 | v86.66,45.16 86.66,8.34 87,7 138,7 140,9 140,41 v142,41 | v142,50 v142,63 | v129,63 129,60 127.55,58.55 DRIVER.4.1
DIR.H
  Bottom 0.813: B1.5 120.23,62.23 121.98,63.63 124.37,63.63 DRIVER.4.3
GND  (5 unrouted)
  Bottom 0.813: 131,37.88 131,41.88 131,42.94
  Bottom 1: S1.1 57.35,31.36 57.35,30.46 | LIMIT1.2 38.19,20.64 38.19,21.32 | 7.05,107 GND1.2 GND1.3 | 69,118.91 69,119 65.75,119 65.52,119 ULTRASONIC.4 | 7.05,101.05 7.05,94 4,94 4,88.75 | 151,104 151.77,104 151.77,90 | IC2.14 151.77,89.94 151.77,90 | 150.52,90 151.77,90
  Bottom 1.016: 114.56,115.48 114.45,115.57 ULN.1.8 108.18,116.69 104.68,118.91 69,118.91 68.45,118.91 | 114.56,115.48 ULTRASONIC1.1 | ENCODER.C.2 4,88.75 4,80 10,80 10,77 12.47,77 IC3.8 | 37.75,8.02 26.94,8.02 26.94,13.52 22.94,13.52 22.94,17.79 27.75,17.79 29.99,17.82 U$1.GND1 | 37.75,8.02 37.75,20.64 LIMIT1.2 41.11,20.64 41.11,34.65 41,34.65 | 37.75,8.02 37.75,7.51 37.62,1.3 144.87,1.3 145.88,1.93 146.03,42.99 2.33K.1 146.15,42.95 | 38.19,21.32 C1.1 | U$5.GND 1.3,21.16 1.3,2.52 7.94,2.52 7.94,8.52 | U$1.GND 7.94,12.74 7.94,8.52 | 160,26.92 159.96,28.87 2.21K.1 165,29.12 165,32 175,32 178,35 178,62 174,66 | 160,26.92 U$3.IN- | 146.15,42.95 131,42.94 DRIVER.2.5 | 146.15,42.95 145,42.92 151,42.92 | 151,42.92 160,42.92 160,26.92 | PROXIMITY4.2 22.94,5.57 22.94,8.52 19.94,8.52 18.23,6.8 18.23,3.69 17.45,2.91 14.55,2.91 13.62,3.83 PROXIMITY3.2 13.62,6.83 11.94,8.52 7.94,8.52 | ULTRASONIC2.4 41,45.68 41,34.65 | ULTRASONIC3.4 41,34.65 | 149.49,42.92 151,42.92 | 7.05,101.05 GND1.5 GND1.4 7.05,107 | GND1.2 GND1.1 11.65,117 45.86,117 GND.1 | PROXIMITY1.2 43.87,63.12 43.87,64 43.87,73 43.94,73.54 PROXIMITY2.2 | 48.17,62.94 PROXIMITY1.2 | IC3.14 20.39,90 22,90 23,91 23,92 | 23,92 23,99 22,100 22,102.22 | 22,103 22,102.22 | 22,102.22 ENCODER.C1.2 22.17,104.17 24,106 30,106 | 30,106 34,102 34,90 34.34,89.66 IC4.14 | 23,92 25,90 25,77 25.04,76.96 IC4.8 | GND.1 GND.2 GND.3 GND.4 GND.5 30,106 | 65.75,119 48.54,119 GND.1 | ULTRASONIC.4 65.52,114.39 70.74,109.77 B1.GND@3 B1.GND@2 | 114.56,115.48 112.82,115.58 | 57.35,30.46 64.31,30.46 70.67,36.15 70.67,52 65.73,52 B1.GND | 330.1 131,69 125,69 124.75,68.67 DRIVER.4.5
  Bottom 1.016: ENCODER.C2.2 138.02,81.75 138,77 146.33,77 IC2.8 | ENCODER.C3.2 140.56,94.77 144.39,98.6 144.39,99.18 ENCODER.A1.2 145.26,102.26 147,104 151,104 | IC2.8 147.65,77 147.88,77.21 150.4,81.45 150.53,88.16 150.52,88.14 150.52,90 150.52,90.05 | DRIVER.1.5 131,37.88 | IC1.14 162.05,83 160,83 160,75.56 165.73,75.55 167.56,74.58 ENCODER.A.2 167.5,68.9 167.5,65.92 | IC2.8 147,76.81 147,69 | 147,69 147,66 167.5,65.92 | IC1.8 173.57,95.43 178.06,95.44 178,66 174,66 | 174,66 167.5,65.92 | 330.1 132.9,68.83 DRIVER.3.5 | 330.1 146.84,68.84 147,69 | B1.GND@1 56.39,54.61 56,55 56,63 47.11,63 PROXIMITY1.2
  Bottom 2: B1.GND@4 110,38.1 110,19.99 119,20 120.34,20 U$3.OUT-
  Bottom 2.54: 24V4.2 168.43,10 159.96,10 U$3.IN-
GND2
  Bottom 1: U$4.4 126,89.83 126.6,89.83 2.32K.1
INT1
  Bottom 1.016: ENCODER.A.4 176,69.43 176,88.01 170.13,88 IC1.5
INT1.A  (via drill 1)
  Top 1.016: v149.7,70.6 144.83,70.6 v143.79,70.71
  Bottom 1.016: IC1.12 159.81,87.81 158.47,86.47 158.47,71.54 149.76,71.54 v149.7,70.6 | v143.79,70.71 120.56,70.71 116,67 114.23,67 B1.3
INT1.B
  Bottom 1.016: LIMIT1.1 37.84,23.7 34.97,23.7 C1.2 31.86,22.91 U$1.D3
INT1.D  (via drill 1)
  Top 1.016: v30,74 v40,74 | v50,74 v50,60
  Bottom 1.016: IC3.12 22.28,84.72 23,84 23,74 v30,74 | v40,74 40,79 50,79 v50,74 | v50,60 50,19 80.36,18.93 80.37,48.4 82.74,51.21 105.02,51.15 105.02,86.02 109,90 113.75,90 B1.18
INT2
  Bottom 1: IC2.5 147,84.86 147,84.85
  Bottom 1.016: 146.83,84.83 145.88,84.83 147,84.85 148.34,84.86 148.84,84.95 148.84,96.95 149.34,98.34 ENCODER.A1.4
INT2.A  (via drill 1)
  Top 1.016: v149,74 v144,74
  Bottom 1.016: IC2.12 152.86,84.86 151.97,83.97 151.81,77.2 v149,74 | v144,74 136,74 133.94,72.22 119.94,72.22 115.85,69.85 B1.2
INT2.B
  Bottom 1.016: U$5.INT 11.94,36.41 11.94,40.52 22.94,40.52 22.94,20.36 U$1.D2
INT2.D  (via drill 1)
  Top 1.016: v52,74 v52,60
  Bottom 1.016: IC4.12 51.42,84.58 52,83 v52,74 | v52,60 52,21 78.6,21 78.6,49 81,52 82,53 103,53 103,88 107,92 113,92 113.71,92.71 B1.19
INT3
  Bottom 1.016: ENCODER.C.4 10.6,83.61 12.25,84.75 12.54,84.75 IC3.5
INT4
  Bottom 1.016: ENCODER.C1.4 27,102.8 27,85 27.42,84.58 IC4.5
INT5  (via drill 1)
  Top 1.016: v130.25,81.73 v130.14,95.16
  Bottom 1.016: ENCODER.C2.4 131.28,76.72 130.25,76.73 v130.25,81.73 | v130.14,95.16 129,97 120,97 118,95 114,95 113.92,95.08 B1.20
INT6  (via drill 1)
  Top 1.016: v132,90 v132,99
  Bottom 1.016: ENCODER.C3.4 132.31,89.69 v132,90 | v132,99 125,99 124.42,98.42 117.42,98.42 116.79,97.79 B1.21
N$1
  Bottom 1.016: B1.SCL 113.89,27.05 I2C.1
N$2
  Bottom 1.016: I2C.2 119,29.69 119,33 113.92,33 B1.SDA
N$3
  Bottom 1.016: B1.AREF 119,35.56 121.54,35.56 I2C.3
N$6
  Bottom 1.016: ANALOG_SPARE.1 57.61,102.87 B1.A15
N$7
  Bottom 2.54: 24V4.1 173.41,26.77 173.18,27.22 F4.1
N$8
  Bottom 1.016: ANALOG_SPARE.2 57.61,100.33 B1.A14
N$9
  Bottom 1.016: ANALOG_SPARE.3 57.18,97.18 58,98 65.45,98 B1.A13
N$10
  Bottom 1.016: ANALOG_SPARE.4 57.36,95 65.41,95 B1.A12
N$11
  Bottom 1.016: ANALOG_SPARE.5 65.05,92.1 B1.A11
N$12
  Bottom 1.016: ANALOG_SPARE.6 65.05,89.56 B1.A10
N$13
  Bottom 1.016: ANALOG_SPARE.7 65.05,87.02 B1.A9
N$14
  Bottom 1.016: ANALOG_SPARE.8 65.05,84.48 B1.A8
N$15
  Bottom 1.016: ANALOG_SPARE.9 62.73,81.94 B1.A7
N$17
  Bottom 1.016: B1.1 116.52,74.69 122.99,74.69 122.43,74.39 SERIAL_MEGA.1
N$18
  Bottom 1.016: B1.0 115.99,77 123,77 121.43,76.93 SERIAL_MEGA.2
N$21
  Bottom 1.016: STATE.K 127.92,74.15 330.2
N$23
  Bottom 1.016: 2.21K.2 151.97,28.87 LED3.K
N$24
  Bottom 1.016: LED4.K 144.33,34.14 2.33K.2
N$25
  Bottom 2.54: F4.2 173.59,37 164,37 164,36.87 D1.A
N$27
  Bottom 1.016: R1.2 57.32,131.41 LED1.A
N$28
  Bottom 1.016: R2.2 72.16,131.41 LED2.A
N$29
  Bottom 1.016: R3.2 86.66,133.48 LED5.A
N$30
  Bottom 1.016: R4.2 98,132.53 98,130 98.25,130 LED6.A
N$31
  Bottom 1.016: R5.2 110.6,130.56 110.73,130.23 LED7.A
N$32
  Bottom 1.016: LED8.A 123.1,132.25 R6.2
N$33
  Bottom 1.016: LED9.A 142.77,130 139,130 139,132.62 141,132.62 141.58,132.62 R7.2
N$35
  Bottom 1.016: B1.23 111.38,108.38 112.62,109.8 120.62,109.8 121.75,110.87 121.75,111.25 ULTRASONIC1.3
N$36
  Bottom 1.016: B1.25 109,108.11 109,111.25 119,111.25 119.21,111.34 ULTRASONIC1.2
N$39
  Bottom 1.016: ANALOG_NANO.1 9.67,30.52 14.2,30.52 U$1.A3
N$40
  Bottom 1.016: ANALOG_NANO.2 9.66,33.06 U$1.A2
N$41
  Bottom 1.016: ULTRASONIC.2 60.44,112.99 61.1,112.15 67.42,105.83 67.44,103.44 69.84,101.47 73.91,101.47 75.82,103.38 B1.50
N$42
  Bottom 1.016: ULTRASONIC.3 62.98,113.86 68.82,107.32 68.88,104.47 70.46,103 72,103 73.28,104.28 B1.52
N$43
  Bottom 1.016: ANALOG_NANO2.1 14.19,20.25 U$1.A7
N$44
  Bottom 1.016: ANALOG_NANO2.2 14.19,22.79 U$1.A6
N$46
  Bottom 0.813: B1.26 106.3,97.7 | 106.34,98.37 106.31,97 109,97 109,102 109.95,102.41 120.02,102.41 122.93,105.07 124.37,106.51 127,106.51
  Bottom 1: 127,106.51 127.97,106.51
  Bottom 1.016: 106.3,97.7 106.34,98.37 | 127.97,106.51 DIGITAL_SPARE1.1
N$47
  Bottom 1.016: ANALOG_SPARE.10 62.73,79.4 B1.A6
N$48
  Bottom 1.016: ANALOG_SPARE.11 62.73,76.86 B1.A5
N$49
  Bottom 1.016: ANALOG_SPARE.12 62.73,74.32 B1.A4
N$50
  Bottom 0.813: B1.28 103.76,103.24 103.78,95.62 110.53,95.58 110.54,101.14 120.99,101.18 124,104 DIGITAL_SPARE1.2
N$51
  Bottom 0.813: B1.30 101.22,102.78 101.33,93.99 101.39,94.56 | 101.47,94 112,94 112,99.9 122.33,99.9 124.63,100.63 124.8,101.46 DIGITAL_SPARE1.3
  Bottom 1.016: 101.39,94.56 101.47,94
N$52
  Bottom 1.016: ANALOG_SPARE.13 62.73,71.78 B1.A3
N$53
  Bottom 1.016: ANALOG_SPARE.14 62.73,69.24 B1.A2
N$54
  Bottom 0.813: 98.68,100.98 98.64,65.05 78,65 77,65 77,33 68.03,22.9 DIGITAL_SPARE2.1
  Bottom 1.016: 98.68,100.98 98.68,101.32 B1.32
N$55
  Bottom 0.813: 96,105.27 96,67 75.67,67 75.63,62 75.63,33.63 67.05,24.36 56.8,24.36 DIGITAL_SPARE2.2
  Bottom 1.016: B1.34 96,105.27
N$75
  Bottom 1.016: DIGITAL_SPARE_MEGA1.7 86.53,116.01 87.46,110.54 87.52,110.48 B1.41
N$76
  Bottom 1.016: DIGITAL_SPARE_MEGA1.5 81.33,116.13 82.29,110.13 83.44,108.56 B1.45
N$77
  Bottom 1.016: DIGITAL_SPARE_MEGA1.6 83.97,116.03 84.9,110.1 85,110 86,107.97 B1.43
N$78
  Bottom 1.016: DIGITAL_SPARE_MEGA1.4 78.67,116.26 79.65,110.1 80.9,108.1 B1.47
N$79
  Bottom 1.016: DIGITAL_SPARE_MEGA1.3 76.01,115.66 77.33,110.42 78.36,108.64 B1.49
N$80
  Bottom 1.016: DIGITAL_SPARE_MEGA1.2 73.48,115.05 75.82,108.08 B1.51
N$81
  Bottom 1.016: DIGITAL_SPARE_MEGA1.1 70.94,116.22 72.91,110.1 73.28,107.72 B1.53
N$122
  Bottom 1.016: U$1.D12 29.43,51.27 36.84,51.27 ULTRASONIC2.2
N$123
  Bottom 1.016: U$1.D11 31.94,43.23 31.94,48.73 36.84,48.73 ULTRASONIC2.3
N$124
  Bottom 1.016: U$1.D10 33.94,40.69 33.94,39.52 37.35,39.52 ULTRASONIC3.2
N$125
  Bottom 1.016: U$1.D9 32.94,38.15 32.94,37.52 37.02,37.52 ULTRASONIC3.3
N$126
  Bottom 1.016: U$1.D8 29.43,34.93 34.74,34.93 34.74,31.96 36.88,31.96 DIGITAL_SPARE_NANO.1
N$127
  Bottom 1.016: U$1.D7 33.3,33.06 33.3,29.42 36.88,29.42 DIGITAL_SPARE_NANO.2
N$128
  Bottom 1.016: U$1.D6 29.43,30.52 31.69,30.52 31.69,27.06 37.4,27.06 DIGITAL_SPARE_NANO.3
N$135
  Bottom 1.016: U$1.RX1 34.29,12.74 SERIAL_NANO.1
N$136
  Bottom 1.016: U$1.TX0 34.29,10.21 SERIAL_NANO.2
PWM.A
  Bottom 1.016: B1.12 114.61,42.49 114.69,42.49 116.17,41 117,41 117,37.51 121,37.51 121.13,37.52 124.01,36.66 124.01,33.41 127.36,30.26 128.2,30.25 DRIVER.1.2
PWM.B
  Bottom 1.016: B1.11 115.28,45.72 116.58,44.42 116.58,44.41 118,43 119,43 119,40 120.99,39.31 124.46,38.34 125.7,38.32 125.67,37.53 125.68,35.87 126.34,35.21 DRIVER.1.4
PWM.C
  Bottom 1.016: B1.9 121.2,50.8 122,50 123.46,50 DRIVER.2.2
PWM.D
  Bottom 1.016: B1.10 116.74,48.26 118,47 118,45 123.54,45 DRIVER.2.4
PWM.E
  Bottom 1.016: B1.8 115.42,55.21 130.14,55.27 130.22,52.74 130.51,52.6 DRIVER.3.2
PWM.F
  Bottom 1.016: B1.7 114,57 114.16,56.84 122.84,56.84 122.85,56.83 128.14,56.83 129.4,57.4 DRIVER.3.4
PWM.G
  Bottom 1.016: B1.6 114.26,59.35 119.95,59.29 121,59.34 121,61 122.4,61.04 DRIVER.4.2
PWM.H
  Bottom 0.813: B1.4 119.77,64.77 121.17,66.17 DRIVER.4.4
RESET.MEGA
  Bottom 0.813: 1K.1 66.28,37.28 67.55,38.95 67.55,43.95 67.55,44.45 B1.RESET
  Bottom 1: S1.2 56.97,37.28 58.04,37.28 1K.1
RX.BLUE
  Bottom 1: 121.03,84.75 U$4.2
  Bottom 1.016: 121.03,84.75 121,83 121,80 121.3,79.7 1.1K.1 126.51,79.73 126.51,79.13 2.32K.2
RX.NANO
  Bottom 1.016: U$1.D5 26.94,27.98 26.94,56 45.78,56 45.77,14.8 84.42,14.77 84.46,46.89 84.15,47.08 108.69,47.1 108.69,82.69 111.09,85.09 B1.16
SCL
  Bottom 1.016: U$5.SCL 6.13,23.7 7.38,24.83 7.4,24.83 8.02,25.45 U$1.A5
SDA
  Bottom 1.016: U$5.SDA 6.56,26.25 6.56,27.98 U$1.A4
STATE
  Bottom 1: U$4.1 123.43,82.52 128.01,82.52 128.31,82.22
  Bottom 1.016: STATE.A 127.86,76.86 128.33,77.19 128.34,78.9 128.31,82.22
TX.BLUE
  Bottom 1: U$4.3 116.54,87.29
  Bottom 1.016: B1.15 116.55,82.55 116.54,87.29
TX.MEGA
  Bottom 1.016: B1.14 117.23,79.7 1.1K.2
TX.NANO
  Bottom 1.016: U$1.D4 24.94,25.45 24.94,58 48,58 48,17 82.38,17.16 82.38,47.79 83.14,49.13 106.92,49.13 106.97,49.19 107,84 110.63,87.63 B1.17

### Text on the board
Bottom: ROBOCON'19 | MIA_ROBOTICS | + | -